# Altium schematic sheet RAM_DDR4_4RANK_BGA78.SchDoc
size A2
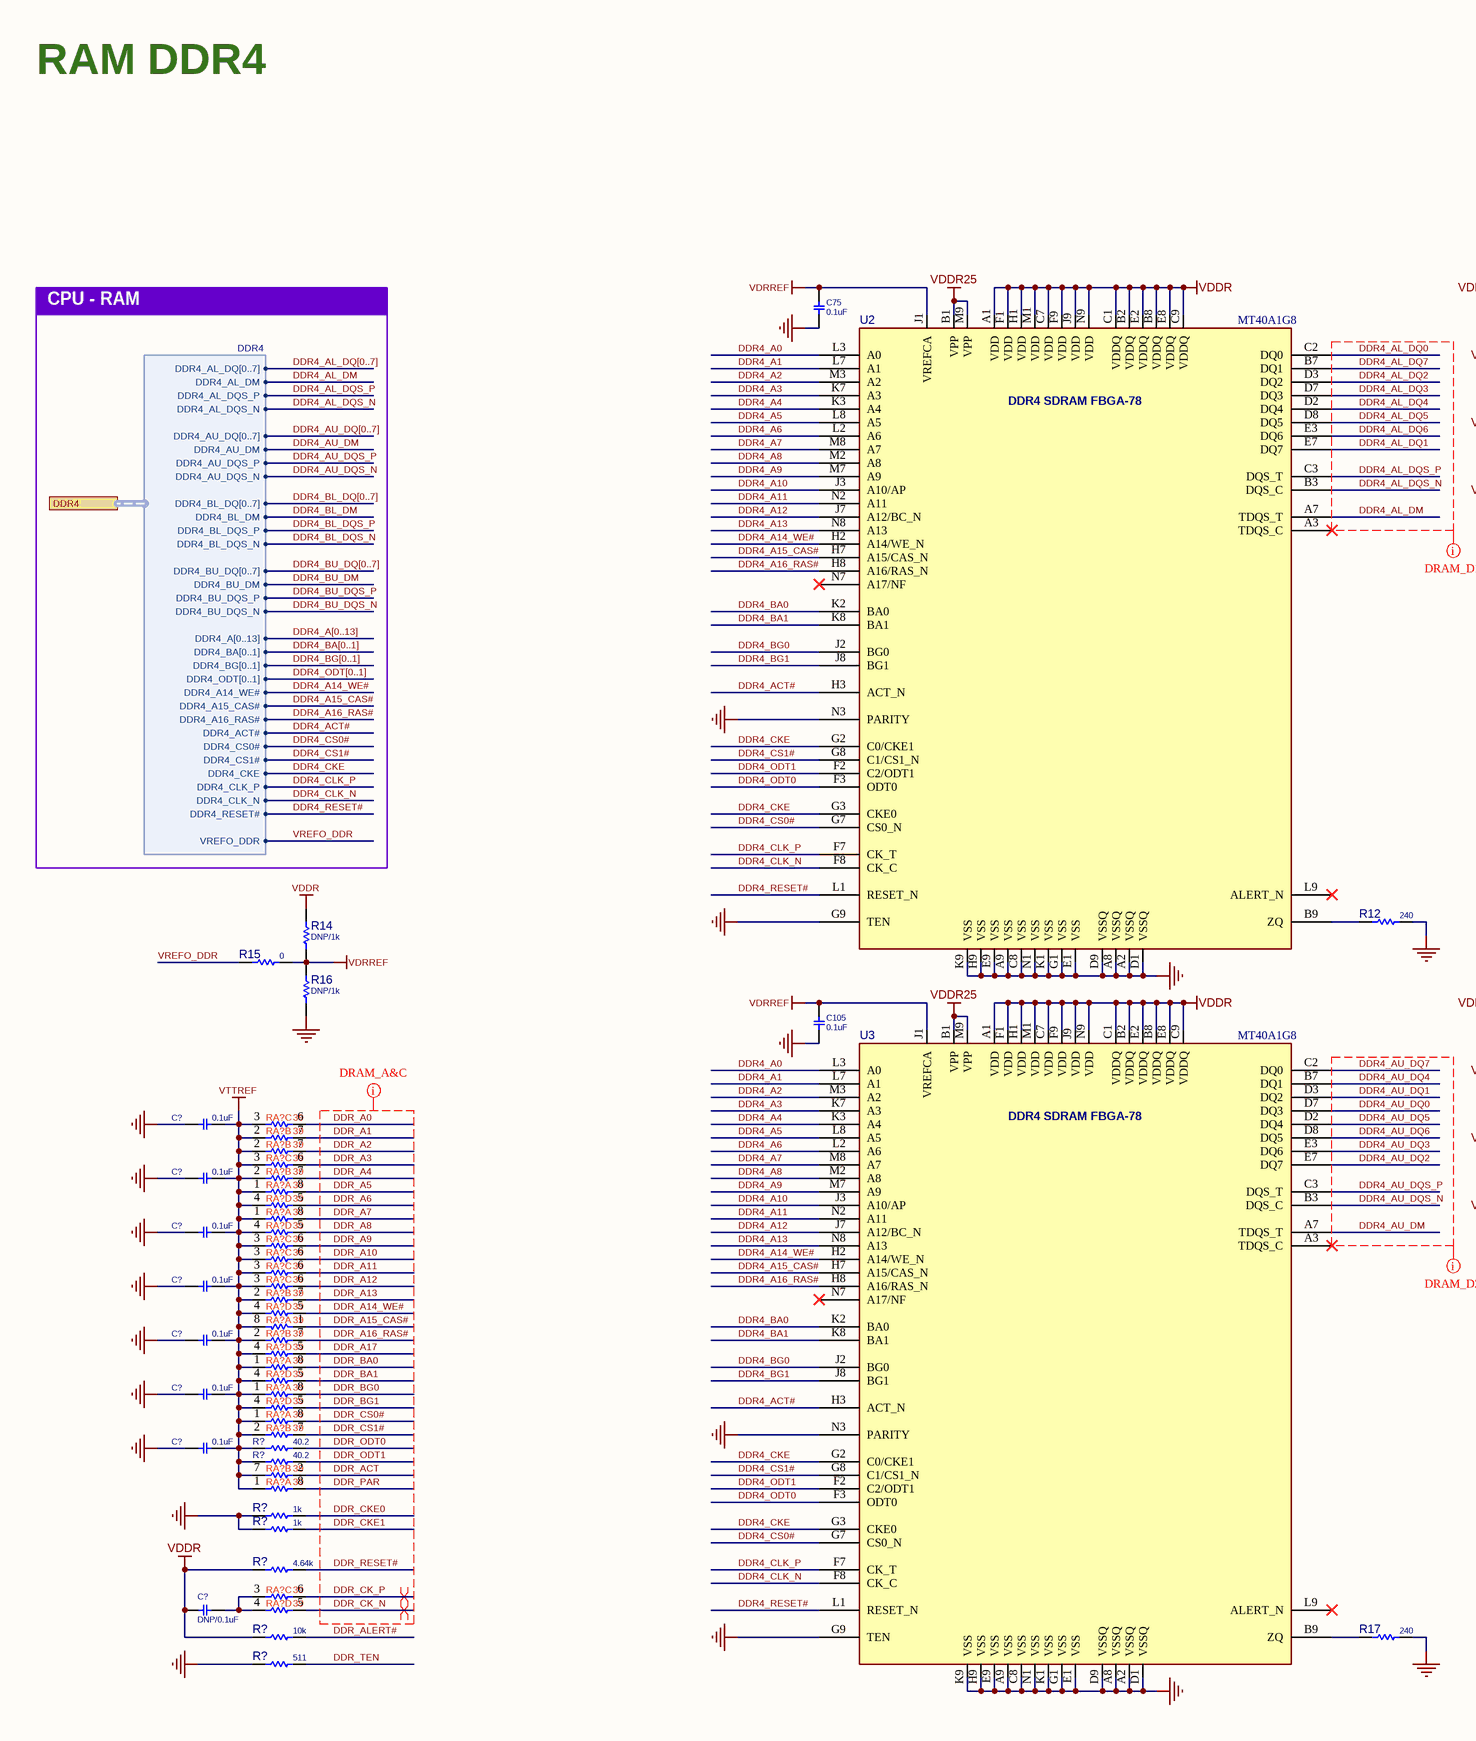
[diagram p0: RAM_DDR4_4RANK_BGA78.SchDoc, left]
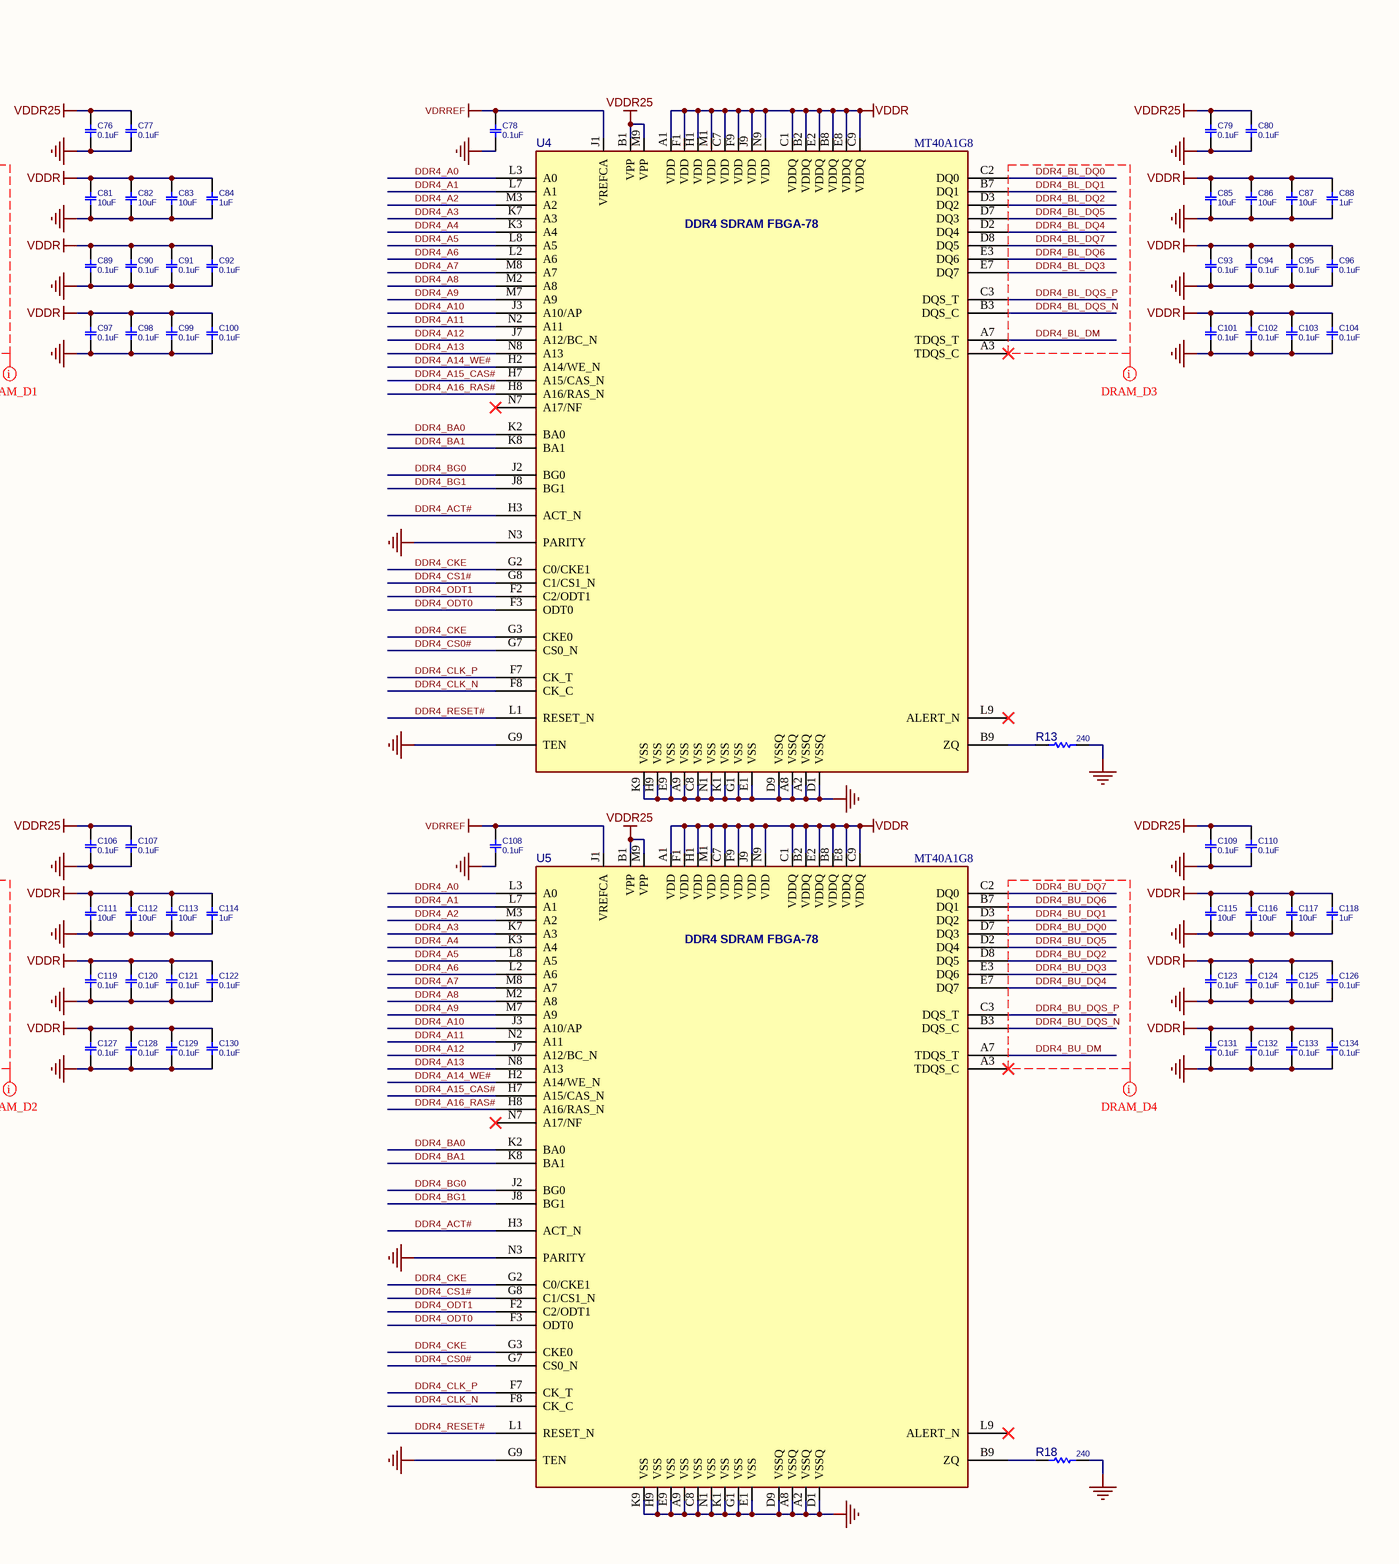
[diagram p1: RAM_DDR4_4RANK_BGA78.SchDoc, right]

## Parts
(Parts that share a designator on the sheet are numbered #1, #2 ... from top to bottom, then left to right.)
C75  0.1uF  [C0402]
C76  0.1uF  [C0402]
C77  0.1uF  [C0402]
C78  0.1uF  [C0402]
C79  0.1uF  [C0402]
C80  0.1uF  [C0402]
C81  10uF  [C0402]
C82  10uF  [C0402]
C83  10uF  [C0402]
C84  1uF  [C0402]
C85  10uF  [C0402]
C86  10uF  [C0402]
C87  10uF  [C0402]
C88  1uF  [C0402]
C89  0.1uF  [C0402]
C90  0.1uF  [C0402]
C91  0.1uF  [C0402]
C92  0.1uF  [C0402]
C93  0.1uF  [C0402]
C94  0.1uF  [C0402]
C95  0.1uF  [C0402]
C96  0.1uF  [C0402]
C97  0.1uF  [C0402]
C98  0.1uF  [C0402]
C99  0.1uF  [C0402]
C100  0.1uF  [C0402]
C101  0.1uF  [C0402]
C102  0.1uF  [C0402]
C103  0.1uF  [C0402]
C104  0.1uF  [C0402]
C105  0.1uF  [C0402]
C106  0.1uF  [C0402]
C107  0.1uF  [C0402]
C108  0.1uF  [C0402]
C109  0.1uF  [C0402]
C110  0.1uF  [C0402]
C111  10uF  [C0402]
C112  10uF  [C0402]
C113  10uF  [C0402]
C114  1uF  [C0402]
C115  10uF  [C0402]
C116  10uF  [C0402]
C117  10uF  [C0402]
C118  1uF  [C0402]
C119  0.1uF  [C0402]
C120  0.1uF  [C0402]
C121  0.1uF  [C0402]
C122  0.1uF  [C0402]
C123  0.1uF  [C0402]
C124  0.1uF  [C0402]
C125  0.1uF  [C0402]
C126  0.1uF  [C0402]
C127  0.1uF  [C0402]
C128  0.1uF  [C0402]
C129  0.1uF  [C0402]
C130  0.1uF  [C0402]
C131  0.1uF  [C0402]
C132  0.1uF  [C0402]
C133  0.1uF  [C0402]
C134  0.1uF  [C0402]
C?#1  0.1uF  [C0402]
C?#2  0.1uF  [C0402]
C?#3  0.1uF  [C0402]
C?#4  0.1uF  [C0402]
C?#5  0.1uF  [C0402]
C?#6  0.1uF  [C0402]
C?#7  0.1uF  [C0402]
C?#8  DNP/0.1uF  [C0402]
R12  240  [R0402]
R13  240  [R0402]
R14  DNP/1k  [R0402]
R15  0  [R0402]
R16  DNP/1k  [R0402]
R17  240  [R0402]
R18  240  [R0402]
R?#1  40.2  [R0402]
R?#2  40.2  [R0402]
R?#3  1k  [R0402]
R?#4  1k  [R0402]
R?#5  4.64k  [R0402]
R?#6  10k  [R0402]
R?#7  511  [R0402]
RA?#1  39  [RP0402X4]  (part C of 4)
RA?#2  39  [RP0402X4]  (part B of 4)
RA?#3  39  [RP0402X4]  (part B of 4)
RA?#4  39  [RP0402X4]  (part C of 4)
RA?#5  39  [RP0402X4]  (part B of 4)
RA?#6  39  [RP0402X4]  (part A of 4)
RA?#7  39  [RP0402X4]  (part D of 4)
RA?#8  39  [RP0402X4]  (part A of 4)
RA?#9  39  [RP0402X4]  (part D of 4)
RA?#10  39  [RP0402X4]  (part C of 4)
RA?#11  39  [RP0402X4A]  (part C of 4)
RA?#12  39  [RP0402X4]  (part C of 4)
RA?#13  39  [RP0402X4A]  (part C of 4)
RA?#14  39  [RP0402X4]  (part B of 4)
RA?#15  39  [RP0402X4A]  (part D of 4)
RA?#16  39  [RP0402X4A]  (part A of 4)
RA?#17  39  [RP0402X4A]  (part B of 4)
RA?#18  39  [RP0402X4]  (part D of 4)
RA?#19  39  [RP0402X4]  (part A of 4)
RA?#20  39  [RP0402X4]  (part D of 4)
RA?#21  39  [RP0402X4A]  (part A of 4)
RA?#22  39  [RP0402X4A]  (part D of 4)
RA?#23  39  [RP0402X4]  (part A of 4)
RA?#24  39  [RP0402X4]  (part B of 4)
RA?#25  39  [RP0402X4A]  (part B of 4)
RA?#26  39  [RP0402X4]  (part A of 4)
RA?#27  39  [RP0402X4]  (part C of 4)
RA?#28  39  [RP0402X4]  (part D of 4)
U2  MT40A1G8  [BGA80_78_10X12]
U3  MT40A1G8  [BGA80_78_10X12]
U4  MT40A1G8  [BGA80_78_10X12]
U5  MT40A1G8  [BGA80_78_10X12]

## Ports
DDR4 (harness DDR4)

## Harnesses
DDR4: DDR4_AL_DQ[0..7], DDR4_AL_DM, DDR4_AL_DQS_P, DDR4_AL_DQS_N, DDR4_AU_DQ[0..7], DDR4_AU_DM, DDR4_AU_DQS_P, DDR4_AU_DQS_N, DDR4_BL_DQ[0..7], DDR4_BL_DM, DDR4_BL_DQS_P, DDR4_BL_DQS_N, DDR4_BU_DQ[0..7], DDR4_BU_DM, DDR4_BU_DQS_P, DDR4_BU_DQS_N, DDR4_A[0..13], DDR4_BA[0..1], DDR4_BG[0..1], DDR4_ODT[0..1], DDR4_A14_WE#, DDR4_A15_CAS#, DDR4_A16_RAS#, DDR4_ACT#, DDR4_CS0#, DDR4_CS1#, DDR4_CKE, DDR4_CLK_P, DDR4_CLK_N, DDR4_RESET#, VREFO_DDR

## Nets
GND: C75.1 C76.1 C77.1 C78.1 C79.1 C80.1 C81.1 C82.1 C83.1 C84.1 C85.1 C86.1 C87.1 C88.1 C89.1 C90.1 C91.1 C92.1 C93.1 C94.1 C95.1 C96.1 C97.1 C98.1 C99.1 C100.1 C101.1 C102.1 C103.1 C104.1 C105.1 C106.1 C107.1 C108.1 C109.1 C110.1 C111.1 C112.1 C113.1 C114.1 C115.1 C116.1 C117.1 C118.1 C119.1 C120.1 C121.1 C122.1 C123.1 C124.1 C125.1 C126.1 C127.1 C128.1 C129.1 C130.1 C131.1 C132.1 C133.1 C134.1 C?#1.2 C?#2.2 C?#3.2 C?#4.2 C?#5.2 C?#6.2 C?#7.2 R12.2 R13.2 R16.2 R17.2 R18.2 R?#3.2 R?#4.2 R?#7.2 U2.A2(VSSQ) U2.A8(VSSQ) U2.A9(VSS) U2.C8(VSS) U2.D1(VSSQ) U2.D9(VSSQ) U2.E1(VSS) U2.E9(VSS) U2.G1(VSS) U2.G9(TEN) U2.H9(VSS) U2.K1(VSS) U2.K9(VSS) U2.N1(VSS) U2.N3(PARITY) U3.A2(VSSQ) U3.A8(VSSQ) U3.A9(VSS) U3.C8(VSS) U3.D1(VSSQ) U3.D9(VSSQ) U3.E1(VSS) U3.E9(VSS) U3.G1(VSS) U3.G9(TEN) U3.H9(VSS) U3.K1(VSS) U3.K9(VSS) U3.N1(VSS) U3.N3(PARITY) U4.A2(VSSQ) U4.A8(VSSQ) U4.A9(VSS) U4.C8(VSS) U4.D1(VSSQ) U4.D9(VSSQ) U4.E1(VSS) U4.E9(VSS) U4.G1(VSS) U4.G9(TEN) U4.H9(VSS) U4.K1(VSS) U4.K9(VSS) U4.N1(VSS) U4.N3(PARITY) U5.A2(VSSQ) U5.A8(VSSQ) U5.A9(VSS) U5.C8(VSS) U5.D1(VSSQ) U5.D9(VSSQ) U5.E1(VSS) U5.E9(VSS) U5.G1(VSS) U5.G9(TEN) U5.H9(VSS) U5.K1(VSS) U5.K9(VSS) U5.N1(VSS) U5.N3(PARITY)
VDDR: C81.2 C82.2 C83.2 C84.2 C85.2 C86.2 C87.2 C88.2 C89.2 C90.2 C91.2 C92.2 C93.2 C94.2 C95.2 C96.2 C97.2 C98.2 C99.2 C100.2 C101.2 C102.2 C103.2 C104.2 C111.2 C112.2 C113.2 C114.2 C115.2 C116.2 C117.2 C118.2 C119.2 C120.2 C121.2 C122.2 C123.2 C124.2 C125.2 C126.2 C127.2 C128.2 C129.2 C130.2 C131.2 C132.2 C133.2 C134.2 C?#8.2 R14.1 R?#5.2 R?#6.2 U2.A1(VDD) U2.B2(VDDQ) U2.B8(VDDQ) U2.C1(VDDQ) U2.C7(VDD) U2.C9(VDDQ) U2.E2(VDDQ) U2.E8(VDDQ) U2.F1(VDD) U2.F9(VDD) U2.H1(VDD) U2.J9(VDD) U2.M1(VDD) U2.N9(VDD) U3.A1(VDD) U3.B2(VDDQ) U3.B8(VDDQ) U3.C1(VDDQ) U3.C7(VDD) U3.C9(VDDQ) U3.E2(VDDQ) U3.E8(VDDQ) U3.F1(VDD) U3.F9(VDD) U3.H1(VDD) U3.J9(VDD) U3.M1(VDD) U3.N9(VDD) U4.A1(VDD) U4.B2(VDDQ) U4.B8(VDDQ) U4.C1(VDDQ) U4.C7(VDD) U4.C9(VDDQ) U4.E2(VDDQ) U4.E8(VDDQ) U4.F1(VDD) U4.F9(VDD) U4.H1(VDD) U4.J9(VDD) U4.M1(VDD) U4.N9(VDD) U5.A1(VDD) U5.B2(VDDQ) U5.B8(VDDQ) U5.C1(VDDQ) U5.C7(VDD) U5.C9(VDDQ) U5.E2(VDDQ) U5.E8(VDDQ) U5.F1(VDD) U5.F9(VDD) U5.H1(VDD) U5.J9(VDD) U5.M1(VDD) U5.N9(VDD)
VDDR25: C76.2 C77.2 C79.2 C80.2 C106.2 C107.2 C109.2 C110.2 U2.B1(VPP) U2.M9(VPP) U3.B1(VPP) U3.M9(VPP) U4.B1(VPP) U4.M9(VPP) U5.B1(VPP) U5.M9(VPP)
VDRREF: C75.2 C78.2 C105.2 C108.2 R14.2 R15.2 R16.1 U2.J1(VREFCA) U3.J1(VREFCA) U4.J1(VREFCA) U5.J1(VREFCA)
VTTREF: C?#1.1 C?#2.1 C?#3.1 C?#4.1 C?#5.1 C?#6.1 C?#7.1 R?#1.1 R?#2.1 RA?#1.3 RA?#2.2 RA?#3.2 RA?#4.3 RA?#5.2 RA?#6.1 RA?#7.4 RA?#8.1 RA?#9.4 RA?#10.3 RA?#11.3 RA?#12.3 RA?#13.3 RA?#14.2 RA?#15.4 RA?#16.8 RA?#17.2 RA?#18.4 RA?#19.1 RA?#20.4 RA?#21.1 RA?#22.4 RA?#23.1 RA?#24.2 RA?#25.7 RA?#26.1
DDR4_A0: U2.L3(A0) U3.L3(A0) U4.L3(A0) U5.L3(A0)
DDR4_A1: U2.L7(A1) U3.L7(A1) U4.L7(A1) U5.L7(A1)
DDR4_A2: U2.M3(A2) U3.M3(A2) U4.M3(A2) U5.M3(A2)
DDR4_A3: U2.K7(A3) U3.K7(A3) U4.K7(A3) U5.K7(A3)
DDR4_A4: U2.K3(A4) U3.K3(A4) U4.K3(A4) U5.K3(A4)
DDR4_A5: U2.L8(A5) U3.L8(A5) U4.L8(A5) U5.L8(A5)
DDR4_A6: U2.L2(A6) U3.L2(A6) U4.L2(A6) U5.L2(A6)
DDR4_A7: U2.M8(A7) U3.M8(A7) U4.M8(A7) U5.M8(A7)
DDR4_A8: U2.M2(A8) U3.M2(A8) U4.M2(A8) U5.M2(A8)
DDR4_A9: U2.M7(A9) U3.M7(A9) U4.M7(A9) U5.M7(A9)
DDR4_A10: U2.J3(A10/AP) U3.J3(A10/AP) U4.J3(A10/AP) U5.J3(A10/AP)
DDR4_A11: U2.N2(A11) U3.N2(A11) U4.N2(A11) U5.N2(A11)
DDR4_A12: U2.J7(A12/BC_N) U3.J7(A12/BC_N) U4.J7(A12/BC_N) U5.J7(A12/BC_N)
DDR4_A13: U2.N8(A13) U3.N8(A13) U4.N8(A13) U5.N8(A13)
DDR4_A14_WE#: U2.H2(A14/WE_N) U3.H2(A14/WE_N) U4.H2(A14/WE_N) U5.H2(A14/WE_N) ; port DDR4.DDR4_A14_WE#
DDR4_A15_CAS#: U2.H7(A15/CAS_N) U3.H7(A15/CAS_N) U4.H7(A15/CAS_N) U5.H7(A15/CAS_N) ; port DDR4.DDR4_A15_CAS#
DDR4_A16_RAS#: U2.H8(A16/RAS_N) U3.H8(A16/RAS_N) U4.H8(A16/RAS_N) U5.H8(A16/RAS_N) ; port DDR4.DDR4_A16_RAS#
DDR4_ACT#: U2.H3(ACT_N) U3.H3(ACT_N) U4.H3(ACT_N) U5.H3(ACT_N) ; port DDR4.DDR4_ACT#
DDR4_AL_DM: U2.A7(TDQS_T) ; port DDR4.DDR4_AL_DM
DDR4_AL_DQ0: U2.C2(DQ0)
DDR4_AL_DQ1: U2.E7(DQ7)
DDR4_AL_DQ2: U2.D3(DQ2)
DDR4_AL_DQ3: U2.D7(DQ3)
DDR4_AL_DQ4: U2.D2(DQ4)
DDR4_AL_DQ5: U2.D8(DQ5)
DDR4_AL_DQ6: U2.E3(DQ6)
DDR4_AL_DQ7: U2.B7(DQ1)
DDR4_AL_DQS_N: U2.B3(DQS_C) ; port DDR4.DDR4_AL_DQS_N
DDR4_AL_DQS_P: U2.C3(DQS_T) ; port DDR4.DDR4_AL_DQS_P
DDR4_AU_DM: U3.A7(TDQS_T) ; port DDR4.DDR4_AU_DM
DDR4_AU_DQ0: U3.D7(DQ3)
DDR4_AU_DQ1: U3.D3(DQ2)
DDR4_AU_DQ2: U3.E7(DQ7)
DDR4_AU_DQ3: U3.E3(DQ6)
DDR4_AU_DQ4: U3.B7(DQ1)
DDR4_AU_DQ5: U3.D2(DQ4)
DDR4_AU_DQ6: U3.D8(DQ5)
DDR4_AU_DQ7: U3.C2(DQ0)
DDR4_AU_DQS_N: U3.B3(DQS_C) ; port DDR4.DDR4_AU_DQS_N
DDR4_AU_DQS_P: U3.C3(DQS_T) ; port DDR4.DDR4_AU_DQS_P
DDR4_BA0: U2.K2(BA0) U3.K2(BA0) U4.K2(BA0) U5.K2(BA0)
DDR4_BA1: U2.K8(BA1) U3.K8(BA1) U4.K8(BA1) U5.K8(BA1)
DDR4_BG0: U2.J2(BG0) U3.J2(BG0) U4.J2(BG0) U5.J2(BG0)
DDR4_BG1: U2.J8(BG1) U3.J8(BG1) U4.J8(BG1) U5.J8(BG1)
DDR4_BL_DM: U4.A7(TDQS_T) ; port DDR4.DDR4_BL_DM
DDR4_BL_DQ0: U4.C2(DQ0)
DDR4_BL_DQ1: U4.B7(DQ1)
DDR4_BL_DQ2: U4.D3(DQ2)
DDR4_BL_DQ3: U4.E7(DQ7)
DDR4_BL_DQ4: U4.D2(DQ4)
DDR4_BL_DQ5: U4.D7(DQ3)
DDR4_BL_DQ6: U4.E3(DQ6)
DDR4_BL_DQ7: U4.D8(DQ5)
DDR4_BL_DQS_N: U4.B3(DQS_C) ; port DDR4.DDR4_BL_DQS_N
DDR4_BL_DQS_P: U4.C3(DQS_T) ; port DDR4.DDR4_BL_DQS_P
DDR4_BU_DM: U5.A7(TDQS_T) ; port DDR4.DDR4_BU_DM
DDR4_BU_DQ0: U5.D7(DQ3)
DDR4_BU_DQ1: U5.D3(DQ2)
DDR4_BU_DQ2: U5.D8(DQ5)
DDR4_BU_DQ3: U5.E3(DQ6)
DDR4_BU_DQ4: U5.E7(DQ7)
DDR4_BU_DQ5: U5.D2(DQ4)
DDR4_BU_DQ6: U5.B7(DQ1)
DDR4_BU_DQ7: U5.C2(DQ0)
DDR4_BU_DQS_N: U5.B3(DQS_C) ; port DDR4.DDR4_BU_DQS_N
DDR4_BU_DQS_P: U5.C3(DQS_T) ; port DDR4.DDR4_BU_DQS_P
DDR4_CKE: U2.G2(C0/CKE1) U2.G3(CKE0) U3.G2(C0/CKE1) U3.G3(CKE0) U4.G2(C0/CKE1) U4.G3(CKE0) U5.G2(C0/CKE1) U5.G3(CKE0) ; port DDR4.DDR4_CKE
DDR4_CLK_N: U2.F8(CK_C) U3.F8(CK_C) U4.F8(CK_C) U5.F8(CK_C) ; port DDR4.DDR4_CLK_N
DDR4_CLK_P: U2.F7(CK_T) U3.F7(CK_T) U4.F7(CK_T) U5.F7(CK_T) ; port DDR4.DDR4_CLK_P
DDR4_CS0#: U2.G7(CS0_N) U3.G7(CS0_N) U4.G7(CS0_N) U5.G7(CS0_N) ; port DDR4.DDR4_CS0#
DDR4_CS1#: U2.G8(C1/CS1_N) U3.G8(C1/CS1_N) U4.G8(C1/CS1_N) U5.G8(C1/CS1_N) ; port DDR4.DDR4_CS1#
DDR4_ODT0: U2.F3(ODT0) U3.F3(ODT0) U4.F3(ODT0) U5.F3(ODT0)
DDR4_ODT1: U2.F2(C2/ODT1) U3.F2(C2/ODT1) U4.F2(C2/ODT1) U5.F2(C2/ODT1)
DDR4_RESET#: U2.L1(RESET_N) U3.L1(RESET_N) U4.L1(RESET_N) U5.L1(RESET_N) ; port DDR4.DDR4_RESET#
DDR_A0: RA?#1.6
DDR_A1: RA?#2.7
DDR_A2: RA?#3.7
DDR_A3: RA?#4.6
DDR_A4: RA?#5.7
DDR_A5: RA?#6.8
DDR_A6: RA?#7.5
DDR_A7: RA?#8.8
DDR_A8: RA?#9.5
DDR_A9: RA?#10.6
DDR_A10: RA?#11.6
DDR_A11: RA?#12.6
DDR_A12: RA?#13.6
DDR_A13: RA?#14.7
DDR_A14_WE#: RA?#15.5
DDR_A15_CAS#: RA?#16.1
DDR_A16_RAS#: RA?#17.7
DDR_A17: RA?#18.5
DDR_ACT: RA?#25.2
DDR_ALERT#: R?#6.1
DDR_BA0: RA?#19.8
DDR_BA1: RA?#20.5
DDR_BG0: RA?#21.8
DDR_BG1: RA?#22.5
DDR_CK_N: RA?#28.5
DDR_CK_P: RA?#27.6
DDR_CKE0: R?#3.1
DDR_CKE1: R?#4.1
DDR_CS0#: RA?#23.8
DDR_CS1#: RA?#24.7
DDR_ODT0: R?#1.2
DDR_ODT1: R?#2.2
DDR_PAR: RA?#26.8
DDR_RESET#: R?#5.1
DDR_TEN: R?#7.1
VREFO_DDR: R15.1 ; port DDR4.VREFO_DDR
NetC?#8_1: C?#8.1 RA?#27.3 RA?#28.4
NetR12_1: R12.1 U2.B9(ZQ)
NetR13_1: R13.1 U4.B9(ZQ)
NetR17_1: R17.1 U3.B9(ZQ)
NetR18_1: R18.1 U5.B9(ZQ)

Not connected (* = marked no-connect by the designer): U2 A3(TDQS_C)* L9(ALERT_N)* N7(A17/NF)*; U3 A3(TDQS_C)* L9(ALERT_N)* N7(A17/NF)*; U4 A3(TDQS_C)* L9(ALERT_N)* N7(A17/NF)*; U5 A3(TDQS_C)* L9(ALERT_N)* N7(A17/NF)*

## Buses and harness runs
bus DDR4_A[0..13]
bus DDR4_AL_DQ[0..7]
bus DDR4_AU_DQ[0..7]
bus DDR4_BA[0..1]
bus DDR4_BG[0..1]
bus DDR4_BL_DQ[0..7]
bus DDR4_BU_DQ[0..7]
bus DDR4_ODT[0..1]

## Layout directives
differential pair: DDR_CK_N, DDR_CK_P
net class DRAM_D1: DDR4_AL_DM, DDR4_AL_DQ0, DDR4_AL_DQ1, DDR4_AL_DQ2, DDR4_AL_DQ3, DDR4_AL_DQ4, DDR4_AL_DQ5, DDR4_AL_DQ6, DDR4_AL_DQ7, DDR4_AL_DQS_N, DDR4_AL_DQS_P
net class DRAM_D2: DDR4_AU_DM, DDR4_AU_DQ0, DDR4_AU_DQ1, DDR4_AU_DQ2, DDR4_AU_DQ3, DDR4_AU_DQ4, DDR4_AU_DQ5, DDR4_AU_DQ6, DDR4_AU_DQ7, DDR4_AU_DQS_N, DDR4_AU_DQS_P
net class DRAM_D3: DDR4_BL_DM, DDR4_BL_DQ0, DDR4_BL_DQ1, DDR4_BL_DQ2, DDR4_BL_DQ3, DDR4_BL_DQ4, DDR4_BL_DQ5, DDR4_BL_DQ6, DDR4_BL_DQ7, DDR4_BL_DQS_N, DDR4_BL_DQS_P
net class DRAM_D4: DDR4_BU_DM, DDR4_BU_DQ0, DDR4_BU_DQ1, DDR4_BU_DQ2, DDR4_BU_DQ3, DDR4_BU_DQ4, DDR4_BU_DQ5, DDR4_BU_DQ6, DDR4_BU_DQ7, DDR4_BU_DQS_N, DDR4_BU_DQS_P
net class DRAM_A&C: DDR_A0, DDR_A1, DDR_A2, DDR_A3, DDR_A4, DDR_A5, DDR_A6, DDR_A7, DDR_A8, DDR_A9, DDR_A10, DDR_A11, DDR_A12, DDR_A13, DDR_A14_WE#, DDR_A15_CAS#, DDR_A16_RAS#, DDR_A17, DDR_ACT, DDR_BA0, DDR_BA1, DDR_BG0, DDR_BG1, DDR_CK_N, DDR_CK_P, DDR_CKE0, DDR_CKE1, DDR_CS0#, DDR_CS1#, DDR_ODT0, DDR_ODT1, DDR_PAR, DDR_RESET#

## Notes on the sheet
- RAM DDR4
- CPU - RAM
- (in symbol DDR4_MT40A1G8_BGA78) DDR4 SDRAM FBGA-78

## Library data of the parts
C75 C78 C105 C108 C?#1-C?#8 = CAP_SMD_MLCC: CAP, MLCC; PARAM: X7R, 10%, -55~125oC; MANF_P#: GRM155R71H104KE14D; MANF: Murata; PARAM2: 50v; PRICE: 100: 0.018$; ASSEMBLY: ASSEMBLY
  C75 C78 C105 C108 C?#1-C?#7: VALUE: 0.1uF
  C?#8: VALUE: DNP/0.1uF
C76 C77 C79 C80 C89-C104 C106 C107 C109 C110 C119-C134 = CAP_SMD_MLCC: CAP, MLCC; PARAM: X5R, 10%; MANF_P#: GRM155R61E104; MANF: Murata; PARAM2: 25v; PRICE: 10,000:	$0.006; ASSEMBLY: ASSEMBLY; VALUE: 0.1uF
C81-C83 C85-C87 C111-C113 C115-C117 = CAP_SMD_MLCC: CAP, MLCC; PARAM: X5R, 10%; MANF_P#: CL05A106MP5NUNC; MANF: Samsung; PARAM2: 10v; PRICE: 10,000: $0.034; ASSEMBLY: ASSEMBLY; VALUE: 10uF
C84 C88 C114 C118 = CAP_SMD_MLCC: CAP, MLCC; PARAM: X5R, 10%; MANF_P#: CL05A105KO5NNND; MANF: Samsung; PARAM2: 16v; PRICE: 50,000:	$0.006; ASSEMBLY: ASSEMBLY; VALUE: 1uF
R12-R18 R?#1-R?#7 = RES_SMD: RESISTOR, SMD; PARAM: 0.063W; DESC: DESCRIPTION; DIST#: MOUSER; PARAM2: 1%; MANF_P#: -; MANF: -; ASSEMBLY: ASSEMBLY; PRICE: 100= 0.3$
  R12 R13 R17 R18: VALUE: 240
  R14 R16: VALUE: DNP/1k
  R15: VALUE: 0
  R?#1 R?#2: VALUE: 40.2
  R?#3 R?#4: VALUE: 1k
  R?#5: VALUE: 4.64k
  R?#6: VALUE: 10k
  R?#7: VALUE: 511
RA?#1-RA?#28 = RES_SMD_PACK_X4: RESISTOR, SMD, PACKX4; MANF_P#: 4D02WGF392JTCE; MANF_P#2: WA04X390JTL, 4D02WGJ0390TCE; MANF: -; Value: 39
U2-U5 = DDR4_MT40A1G8_BGA78: DDR4 SDRAM, 8Gb (1Gb X8), 1.2V, FBGA-78; MANF: MICRON; MANF_P#: MT40A1G8SA-062E; PARAM2: 1.2VDDQ, 2.5VPP; VALUE: MT40A1G8